# EAGLE design MrMIDI RevA (EAGLE 6.6.0)
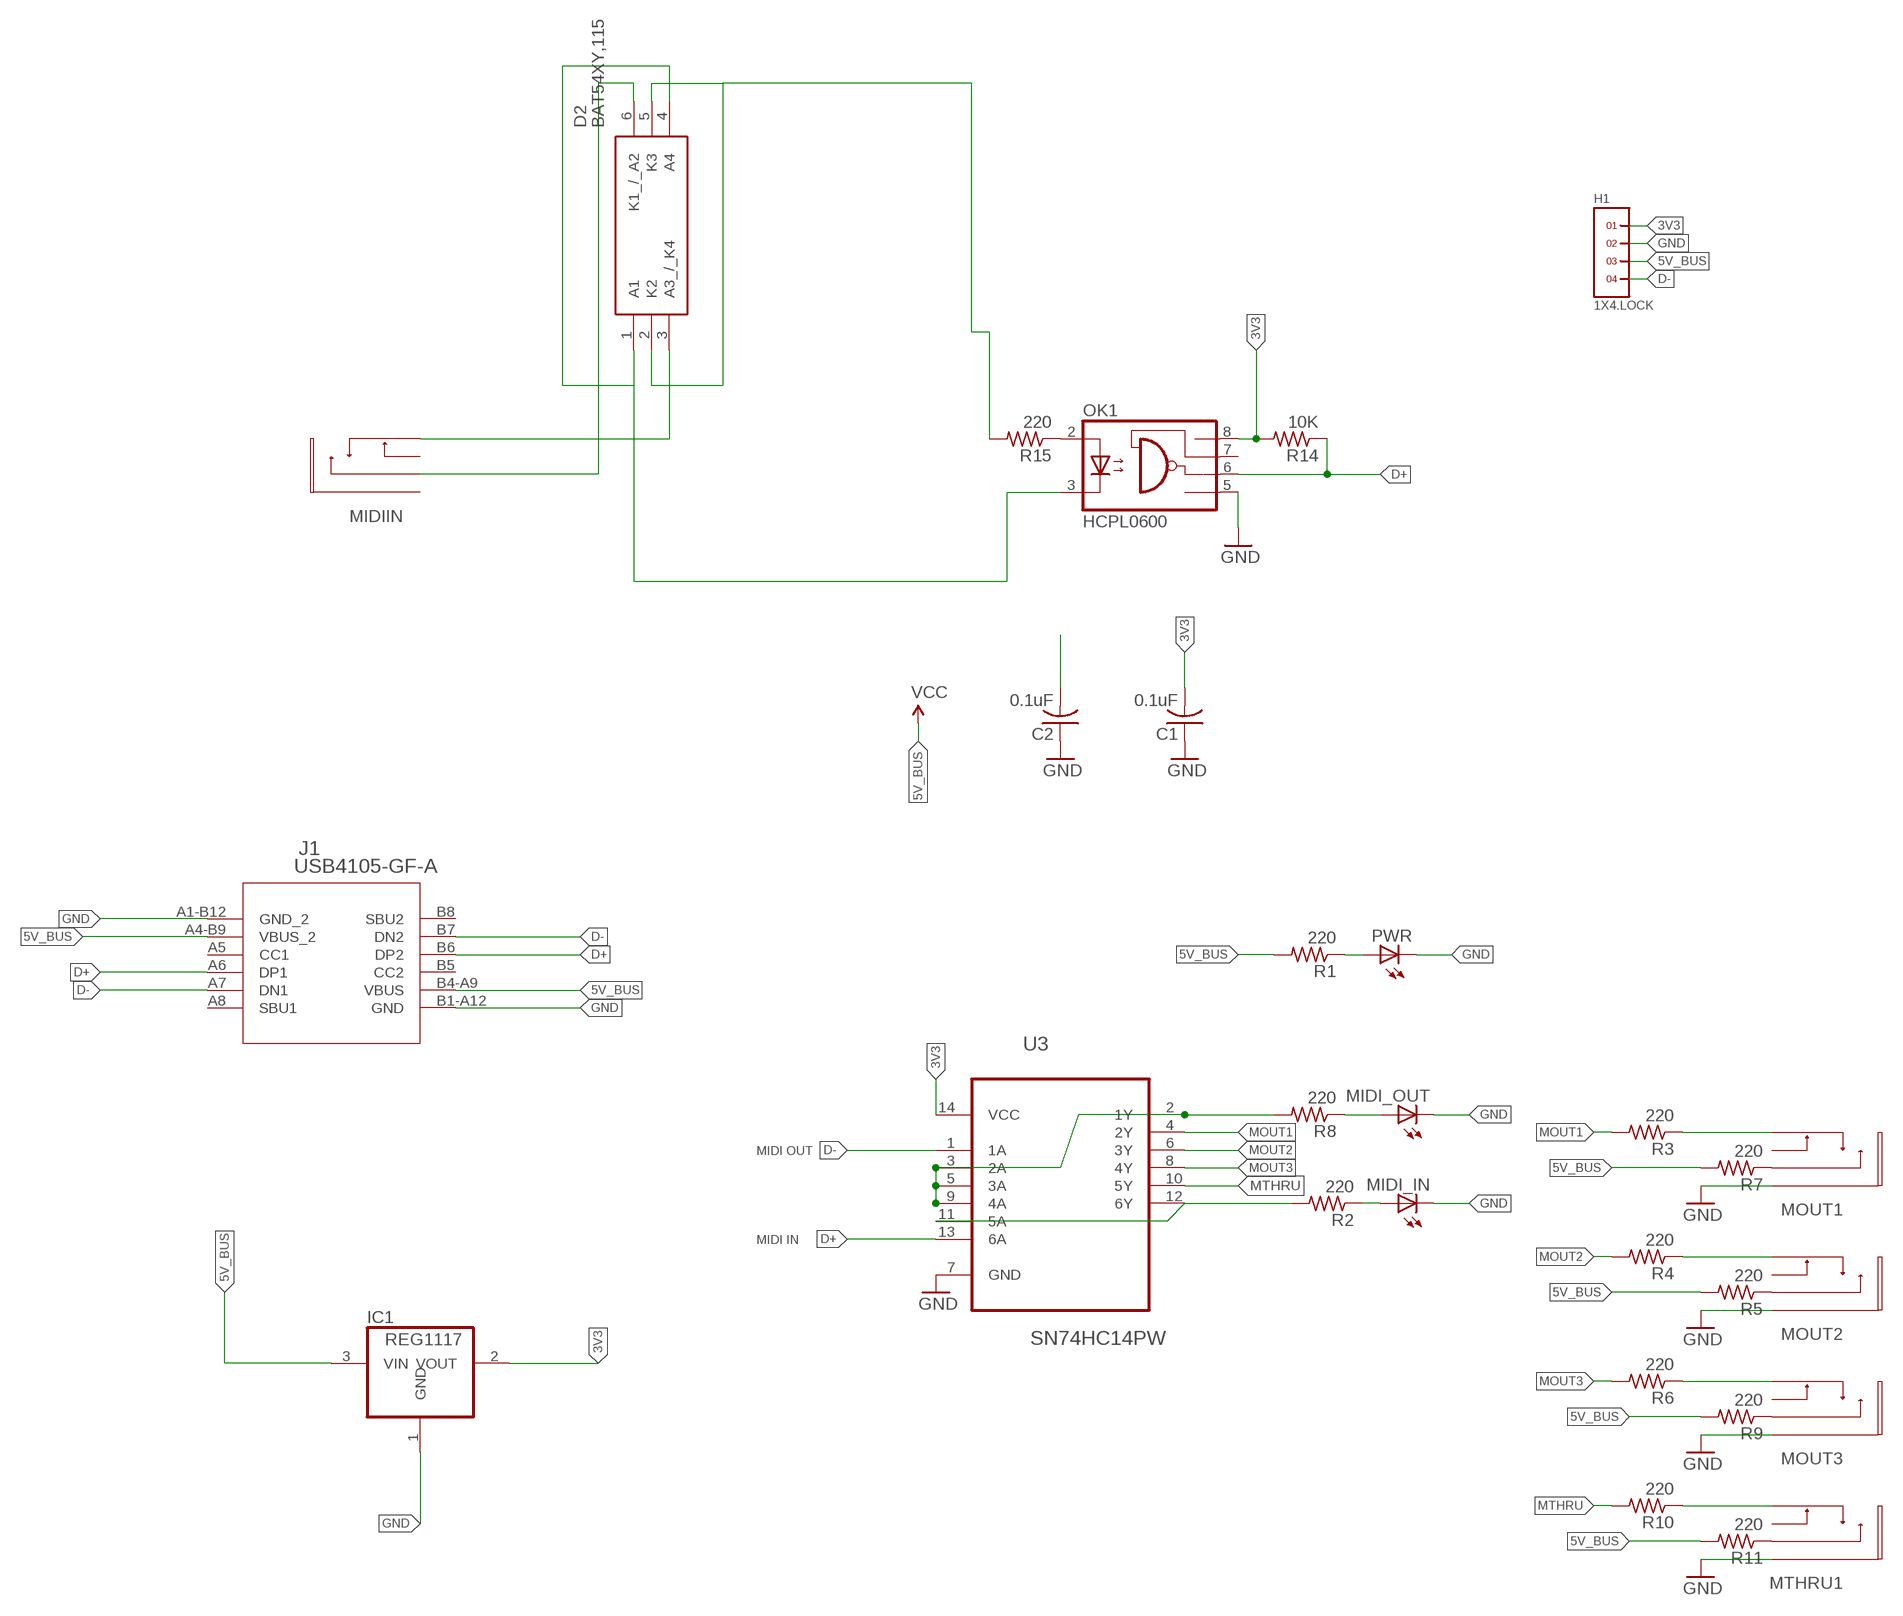
[diagram p0: schematic, sheet 1]

## Parts
C1  0.1uF  RCL_C-USC0603K  [RCL_C0603K]
C2  0.1uF  RCL_C-USC0603K  [RCL_C0603K]
D2  BAT54XY,115  [SOT65P210X110-6N]
H1  1X4.LOCK  [1X4.LOCK]
IC1  REG1117  [SOT223]
J1  USB4105-GF-A  [USB4105_GCT]
MIDI_IN  LEDCHIPLED_0603  [CHIPLED_0603]
MIDI_OUT  LEDCHIPLED_0603  [CHIPLED_0603]
MIDIIN  PJ327E  [PJ327]
MOUT1  PJ327E  [PJ327]
MOUT2  PJ327E  [PJ327]
MOUT3  PJ327E  [PJ327]
MTHRU1  PJ327E  [PJ327]
OK1  HCPL0600  [SOIC08]
PWR  LEDCHIPLED_0603  [CHIPLED_0603]
R1  220  RCL_R-US_R0402  [RCL_R0402]
R2  220  RCL_R-US_R0402  [RCL_R0402]
R3  220  RCL_R-US_R0402  [RCL_R0402]
R4  220  RCL_R-US_R0402  [RCL_R0402]
R5  220  RCL_R-US_R0402  [RCL_R0402]
R6  220  RCL_R-US_R0402  [RCL_R0402]
R7  220  RCL_R-US_R0402  [RCL_R0402]
R8  220  RCL_R-US_R0402  [RCL_R0402]
R9  220  RCL_R-US_R0402  [RCL_R0402]
R10  220  RCL_R-US_R0402  [RCL_R0402]
R11  220  RCL_R-US_R0402  [RCL_R0402]
R14  10K  RCL_R-US_R0402  [RCL_R0402]
R15  220  RCL_R-US_R0402  [RCL_R0402]
U3  SN74HC14PW  [SOP65P640X120-14N]

## Nets
3V3: C1.2 H1.1 IC1.2(VOUT) OK1.8(VCC) R14.2 U3.14(VCC)
5V_BUS: C2.2 H1.3 IC1.3(VIN) J1.A4-B9(VBUS_2) J1.B4-A9(VBUS) R1.2 R5.2 R7.2 R9.2 R11.2 ; supply symbol labelled VCC
D+: J1.A6(DP1) J1.B6(DP2) OK1.6(VO) R14.1 U3.13(6A)
D-: H1.4 J1.A7(DN1) J1.B7(DN2) U3.1(1A)
GND: C1.1 C2.1 H1.2 IC1.1(GND) J1.A1-B12(GND_2) J1.B1-A12(GND) MIDI_IN.C MIDI_OUT.C MOUT1.P$1 MOUT1.P$4 MOUT2.P$1 MOUT2.P$4 MOUT3.P$1 MOUT3.P$4 MTHRU1.P$1 MTHRU1.P$4 OK1.5(GND) PWR.C U3.7(GND)
MIDI_IN_RING: D2.6(K1_/_A2) MIDIIN.P$3
MIDI_IN_TIP: D2.3(A3_/_K4) MIDIIN.P$2
MOUT1: R3.2 U3.4(2Y)
MOUT2: R4.2 U3.6(3Y)
MOUT3: R6.2 U3.8(4Y)
MTHRU: R10.2 U3.10(5Y)
N$1: MIDI_OUT.A R8.1
N$3: D2.1(A1) D2.4(A4) OK1.3(C)
N$5: R2.2 U3.11(5A) U3.12(6Y)
N$6: R8.2 U3.2(1Y) U3.3(2A) U3.5(3A) U3.9(4A)
N$7: MOUT1.P$3 R7.1
N$8: MOUT1.P$2 R3.1
N$9: MOUT2.P$3 R5.1
N$10: MOUT2.P$2 R4.1
N$11: MOUT3.P$3 R9.1
N$12: MOUT3.P$2 R6.1
N$13: MTHRU1.P$3 R11.1
N$14: MTHRU1.P$2 R10.1
N$15: MIDI_IN.A R2.1
N$17: OK1.2(A) R15.1
N$19: D2.2(K2) D2.5(K3) R15.2
N$21: PWR.A R1.1
Unconnected: J1.A5(CC1) J1.A8(SBU1) J1.B5(CC2) J1.B8(SBU2) MIDIIN.P$1 MIDIIN.P$4 MIDIIN.P$5 MOUT1.P$5 MOUT2.P$5 MOUT3.P$5 MTHRU1.P$5 OK1.7(VE)

## Notes on the sheet
- MIDI OUT
- MIDI IN

## Library data of the parts
C1 C2 = ioboard:RCL_C-US: CAPACITOR, American symbol
D2 = SamacSys_Parts:BAT54XY,115: Nexperia BAT54XY,115 Quad SMT Schottky Diode, 2x Series Pair, 30V 200mA, 6-Pin SOT-363 Source: Datasheet <https://assets.nexperia.com/documents/data-sheet/BAT54XY.pdf>; DESCRIPTION: Nexperia BAT54XY,115 Quad SMT Schottky Diode, 2x Series Pair, 30V 200mA, 6-Pin SOT-363; HEIGHT: 1.1mm; MANUFACTURER_NAME: Nexperia; MANUFACTURER_PART_NUMBER: BAT54XY,115; MOUSER_PART_NUMBER: 771-BAT54XY-T/R; MOUSER_PRICE-STOCK: https://www.mouser.co.uk/ProductDetail/Nexperia/BAT54XY115?qs=me8TqzrmIYV24GB%252BtDdQuA%3D%3D
H1 = headers(.1in):1X4
IC1 = clouds_v02:REG1117: 800mA and 1A Low Dropout (LDO) Positive Regulator 1.8V, 2.5V, 2.85V, 3.3V, 5V, and Adj
J1 = 0Raph's Lib:USB4105-GF-A; COPYRIGHT: Copyright (C) 2022 Ultra Librarian. All rights reserved.; DIGI-KEY_PART_NUMBER_1: 2073-USB4105-GF-ACT-ND; DIGI-KEY_PART_NUMBER_2: 2073-USB4105-GF-ADKR-ND; DIGI-KEY_PART_NUMBER_3: 2073-USB4105-GF-ATR-ND; MANUFACTURER_PART_NUMBER: USB4105-GF-A; MFR_NAME: Global Connector Technology
MIDI_IN MIDI_OUT PWR = led:LED: LED OSRAM: - CHIPLED LG R971, LG N971, LY N971, LG Q971, LY Q971, LO R971, LY R971 LH N974, LH R974 LS Q976, LO Q976, LY Q976 LO Q996 - Hyper CHIPLED LW Q18S LB Q993, LB Q99A, LB R99A - SideLED LS A670, LO A670, LY A670, LG A670, LP A670 LB A673, LV A673, LT A673, LW A673 LH A674 LY A675 LS A676, LA A676, LO A676, LY A676, LW A676 LS A679, LY A679, LG A679 - Hyper Micro SIDELED® LS Y876, LA Y876, LO Y876, LY Y876 LT Y87S - SmartLED LW L88C, LW L88S LB L89C, LB L89S, LG L890 LS L89K, LO L89K, LY L89K LS L896, LA L896, LO L896, LY L896 - TOPLED LS T670, LO T670, LY T670, LG T670, LP T670 LSG T670, LSP T670, LSY T670, LOP T670, LYG T670 LG T671, LOG T671, LSG T671 LB T673, LV T673, LT T673, LW T673 LH T674 LS T676, LA T676, LO T676, LY T676, LB T676, LH T676, LSB T676, LW T676 LB T67C, LV T67C, LT T67C, LS T67K, LO T67K, LY T67K, LW E67C LS E67B, LA E67B, LO E67B, LY E67B, LB E67C, LV E67C, LT E67C LW T67C LS T679, LY T679, LG T679 LS T770, LO T770, LY T770, LG T770, LP T770 LB T773, LV T773, LT T773, LW T773 LH T774 LS E675, LA E675, LY E675, LS T675 LS T776, LA T776, LO T776, LY T776, LB T776 LHGB T686 LT T68C, LB T68C - Hyper Mini TOPLED® LB M676 - Mini TOPLED Santana® LG M470 LS M47K, LO M47K, LY M47K Source: http://www.osram.convergy.de LUXEON: - LUMILED® LXK2-PW12-R00, LXK2-PW12-S00, LXK2-PW14-U00, LXK2-PW14-V00 LXK2-PM12-R00, LXK2-PM12-S00, LXK2-PM14-U00 LXK2-PE12-Q00, LXK2-PE12-R00, LXK2-PE12-S00, LXK2-PE14-T00, LXK2-PE14-U00 LXK2-PB12-K00, LXK2-PB12-L00, LXK2-PB12-M00, LXK2-PB14-N00, LXK2-PB14-P00, LXK2-PB14-Q00 LXK2-PR12-L00, LXK2-PR12-M00, LXK2-PR14-Q00, LXK2-PR14-R00 LXK2-PD12-Q00, LXK2-PD12-R00, LXK2-PD12-S00 LXK2-PH12-R00, LXK2-PH12-S00 LXK2-PL12-P00, LXK2-PL12-Q00, LXK2-PL12-R00 Source: www.luxeon.com KINGBRIGHT: KA-3528ASYC Source: www.kingbright.com
MIDIIN MOUT1-MOUT3 MTHRU1 = 0Raph's Lib:PJ327E
OK1 = optocoupler-2:HCPL0600: HEWLETT PACKARD OPTO COUPLER
R1-R11 R14 R15 = warps_v30:RCL_R-US_: RESISTOR, American symbol
U3 = Raph's Lib:SN74HC14PW: HEX SCHMITT-TRIGGER INVERTERS; MPN: SN74HC14PW; OC_FARNELL: 9591133; OC_NEWARK: 02H5414; PACKAGE: TSSOP-14; SUPPLIER: Texas Instruments

## Board
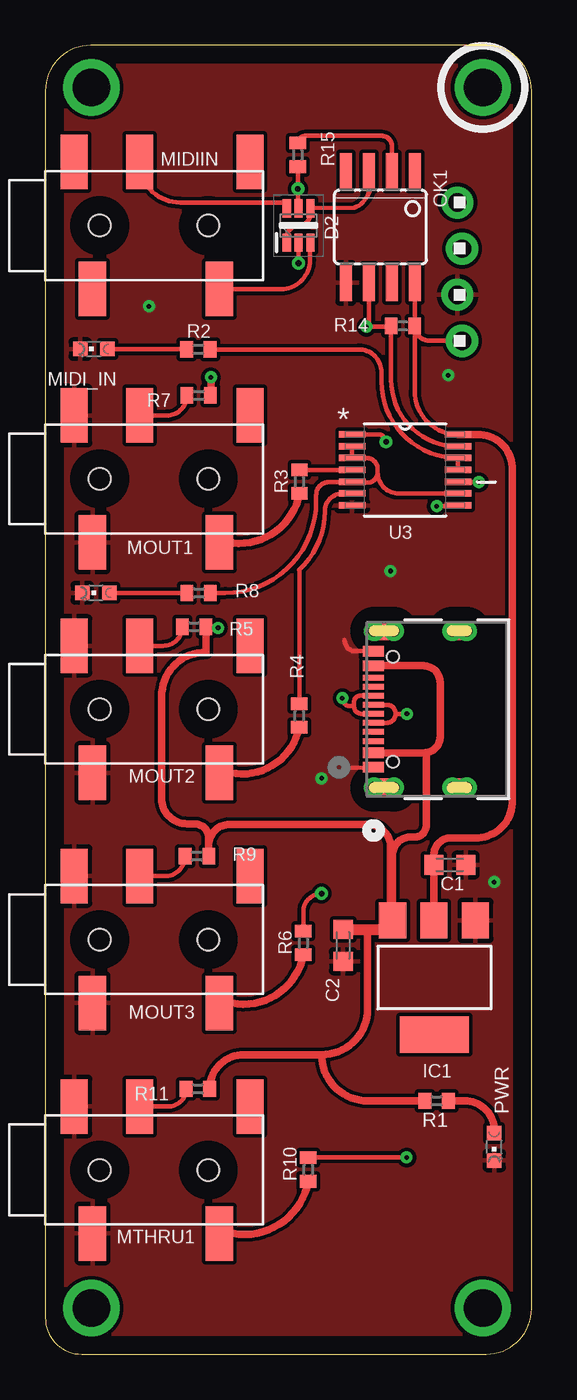
[diagram p1: board, top side]
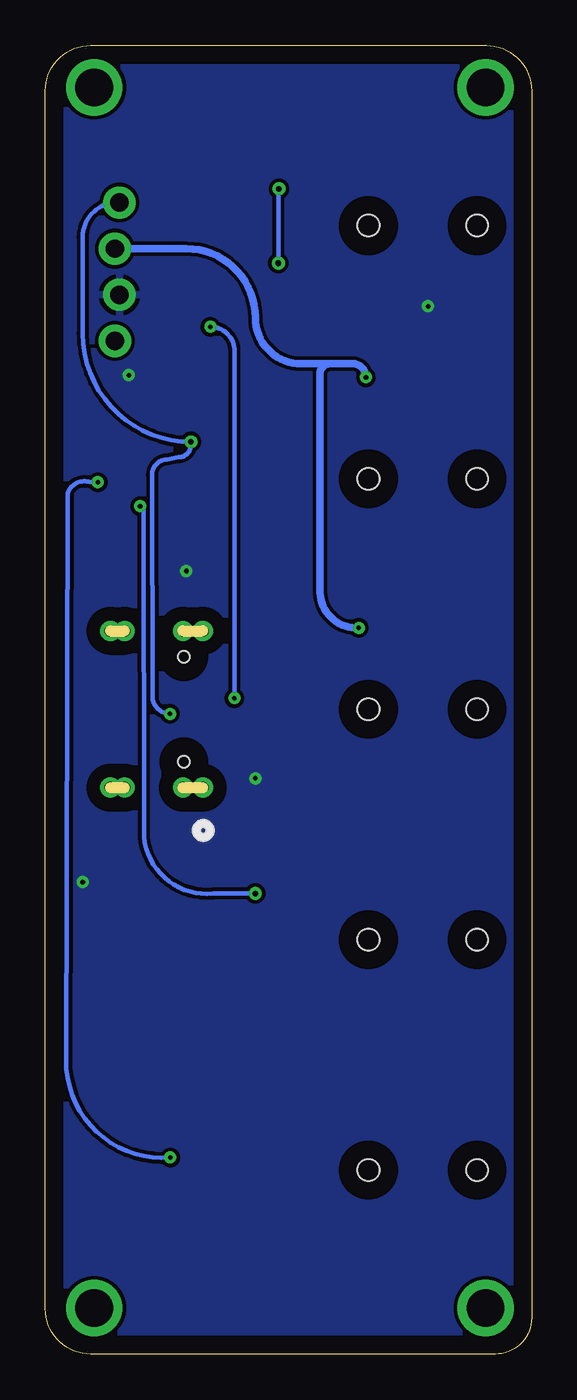
[diagram p2: board, bottom side, seen from below]

Size 26.82 x 72.17 mm. Coordinates in mm from the lower left corner, seen from the top.
Outline: 2,0 24.32,0 arc90 26.82,2.5 26.82,69.67 arc90 24.32,72.17 2.5,72.17 arc90 0,69.67 0,2 arc90 2,0
Copper layers (1*16): Top 0.035mm / dielectric 1.5mm / Bottom 0.035mm
Design rules "default": minimum track width 10mil, minimum drill 24mil, track to track 8mil, track to pad 8mil, pad to pad 8mil, via to via 8mil, smd to smd 8mil, copper to edge 40mil, drill to drill 8mil, minimum pad ring 10mil, minimum via ring 8mil, stop-mask expansion 4mil, vias tented up to drill 25mil, thermal gap 10mil

### Footprints (pad centres in the part's own frame; a part is rotated, then mirrored left to right if it is on the bottom)
RCL_C0603K = smd 1.05 x 1.08: 1 -0.875,0; 2 0.875,0
SOT65P210X110-6N = smd 1 x 0.45: 1 -0.95,0.65; 2 -0.95,0; 3 -0.95,-0.65; 4 0.95,-0.65; 5 0.95,0; 6 0.95,0.65
1X4.LOCK = drill 1.016 pad 1.778: 1 0,-0.127; 2 2.54,0.127; 3 5.08,-0.127; 4 7.62,0.127
SOT223 = smd 1.499 x 2.007: 1 -2.261,-3.15; 2 0.025,-3.15; 3 2.311,-3.15 | smd 3.81 x 2.007: 4 0,3.15
USB4105_GCT = smd 0.991 x 1.803: 13 -4.32,-1.269; 14 4.32,-1.269 | smd 0.991 x 2.108: 15 -4.32,2.911; 16 4.32,2.911 | smd 0.584 x 1.143: A1-B12 -3.2,3.486; A4-B9 -2.4,3.486; B1-A12 3.2,3.486; B4-A9 2.4,3.486 | smd 0.305 x 1.143: A5 -1.25,3.486; A6 -0.25,3.486; A7 0.25,3.486; A8 1.25,3.486; B5 1.75,3.486; B6 0.75,3.486; B7 -0.75,3.486; B8 -1.75,3.486 | drill 0.61 pad 0.61: S_1_H1 -4.318,-0.864; S_1_H2 -4.318,-1.651; S_2_H1 4.318,-0.864; S_2_H2 4.318,-1.651; S_3_H1 -4.318,3.454; S_3_H2 -4.318,2.362; S_4_H1 4.318,3.454; S_4_H2 4.318,2.362 | hole 0.65: -2.896,2.413; 2.896,2.413
CHIPLED_0603 = smd 0.8 x 0.8: A 0,-0.75; C 0,0.75
PJ327 = smd 1.5 x 3: P$1 1.6,3.5; P$2 9.6,-3.5; P$3 5.2,3.5; P$4 2.6,-3.5; P$5 11.3,3.5 | hole 1.2: 3,0; 9,0
SOIC08 = smd 0.66 x 2.032: 1 -1.905,-3.073; 2 -0.635,-3.073; 3 0.635,-3.073; 4 1.905,-3.073; 5 1.905,3.073; 6 0.635,3.073; 7 -0.635,3.073; 8 -1.905,3.073
RCL_R0402 = smd 0.7 x 0.9: 1 -0.65,0; 2 0.65,0
SOP65P640X120-14N = smd 1.473 x 0.356: 1 -2.921,1.956; 2 -2.921,1.295; 3 -2.921,0.66; 4 -2.921,0; 5 -2.921,-0.66; 6 -2.921,-1.295; 7 -2.921,-1.956; 8 2.921,-1.956; 9 2.921,-1.295; 10 2.921,-0.66; 11 2.921,0; 12 2.921,0.66; 13 2.921,1.295; 14 2.921,1.956

### Placement (x,y rotation side)
C1  22.32,26.98 180 top
C2  16.43,22.54 90 top
D2  13.97,62.23 90 top
H1  22.86,55.88 90 top
IC1  21.47,20.77 180 top
J1  21.59,35.56 90 top
MIDI_IN  2.68,55.42 90 top
MIDI_OUT  2.79,41.98 90 top
MIDIIN  0,62.23 0 top
MOUT1  0,48.26 0 top
MOUT2  0,35.56 0 top
MOUT3  0,22.86 0 top
MTHRU1  0,10.16 0 top
OK1  18.49,62.15 180 top
PWR  24.77,11.43 180 top
R1  21.59,13.97 180 top
R2  8.44,55.4 0 top
R3  14.02,48.11 90 top
R4  14.01,35.21 90 top
R5  8.21,40.11 0 top
R6  14.24,22.67 90 top
R7  8.46,52.86 0 top
R8  8.46,41.97 0 top
R9  8.37,27.47 0 top
R10  14.5,10.18 90 top
R11  8.41,14.63 0 top
R14  19.73,56.7 0 top
R15  13.93,66.13 270 top
U3  19.85,48.75 0 top
U$1  [MSW_LOGO_0.5"]  17.11,10.73 0 top

### Tracks (layer width: path | path; a pad name or v marks a point on that pad's centre or on a via)
3V3
  Top 0.254: OK1.8 20.39,56.72 arc-90 R14.2 | R14.2 20.38,53.1 arc90 U3.14 | H1.1 21.2,55.88 arc-90 R14.2
  Top 0.406: IC1.2 C1.2 arc90 C1.2 21.44,27.53 arc-90 22.39,28.47 23.69,28.47 arc90 25.76,30.38 25.75,48.77 arc90 24.01,50.7 U3.14 arc-90 U3.14
5V_BUS  (via drill 0.25)
  Top 0.254: J1.A4-B9 arc90 J1.A4-B9
  Top 0.406: J1.B4-A9 20.85,37.96 arc-90 21.78,37.03 21.78,34.02 arc-90 20.92,33.16 | 20.92,33.16 J1.A4-B9 | IC1.3 19.16,27.54 arc-90 20.13,28.51 20.37,28.51 arc90 21.02,29.15 21.02,33.06 arc90 20.92,33.16 | R11.2 arc-90 10.95,16.51 15.24,16.51 | 15.24,16.51 arc90 17.78,19.05 17.78,23.42 | R9.2 9.02,28.07 | 9.02,28.07 arc-90 10.16,29.21 17.78,29.21 arc-90 19.05,27.94 19.05,23.42 | 9.02,28.07 9.02,28.46 arc90 8.23,29.25 7.81,29.25 arc-90 6.42,30.64 6.42,36.27 arc-90 8.86,38.71 8.86,40.1 arc90 R5.2 arc90 8.91,40.05 v9.53,40.05 | R7.2 arc90 9.14,52.89 v9.14,53.87 | R1.2 17.78,13.97 arc-90 15.24,16.51
  Top 0.61: C2.2 17.78,23.42 19.05,23.42 19.16,23.42 IC1.3
  Bottom 0.406: v9.14,53.87 arc-90 9.89,54.62 11.08,54.62 | 11.08,54.62 arc-90 11.67,54.04 11.67,41.98 arc-90 v9.53,40.05 | H1.3 19.05,60.96 arc90 15.24,57.15 arc-90 12.7,54.61 11.1,54.61 arc-90 11.08,54.62
D+  (via drill 0.25)
  Top 0.254: U3.13 arc-90 19.08,53.74 R14.1 arc-90 19.02,56.65 v17.71,56.65 arc90 17.85,56.79 OK1.6 | J1.A6 17.45,35.31 arc-90 17.03,35.73 | 17.03,35.73 17.03,35.96 arc-90 17.38,36.31 J1.B6 arc90 J1.B6 | 17.03,35.73 16.83,35.73 arc-90 v16.39,36.17
  Bottom 0.254: v16.39,36.17 16.39,55.32 arc-90 v17.71,56.65
D-  (via drill 0.25, 0.3)
  Top 0.254: J1.B7 18.82,34.81 arc90 19.32,35.31 19.32,35.32 | 19.32,35.32 arc90 18.84,35.81 J1.A7 arc-90 J1.A7 | U3.1 18.39,50.71 arc-90 v18.79,50.31 | v19.95,35.31 19.33,35.31 arc-90 19.32,35.32
  Bottom 0.254: v19.95,35.31 arc90 20.91,36.29 20.94,48.49 arc90 20.09,49.33 19.47,49.46 arc-90 18.79,50.14 v18.79,50.31 arc90 24.77,56.28 24.77,61.59 arc90 22.86,63.5 H1.4
GND  (via drill 0.25)
  Top 0.254: J1.A1-B12 16.72,32.32 arc-90 16.67,32.38 | J1.B1-A12 17.12,38.76 arc-90 16.51,39.37
  other vias: 15.24,31.75 24.77,26.04 22.23,53.97 5.71,57.78 19.05,43.18
  pour Top: 0,77.47 27.94,77.47 27.94,-6.35 0,-6.35
  pour Bottom: -10.16,76.2 33.02,76.2 33.02,-5.08 -10.16,-5.08
MIDI_IN_RING
  Top 0.254: MIDIIN.P$3 arc90 7.43,63.5 13,63.5 arc-90 D2.6
MIDI_IN_TIP
  Top 0.254: MIDIIN.P$2 13.01,58.73 arc90 14.61,60.33 14.61,61.27 arc-90 D2.3
MOUT1
  Top 0.254: R3.2 U3.4 arc-90 U3.4
MOUT2
  Top 0.254: U3.6 16.4,47.46 arc90 15.42,46.48 arc-48 13.99,43.23 14.01,43.23 R4.2
MOUT3  (via drill 0.25, 0.3)
  Top 0.254: R6.2 14.24,24.4 arc-90 v15.24,25.4 | v21.59,46.75 22.73,46.76 arc90 U3.8
  Bottom 0.254: v15.24,25.4 17.58,25.4 arc90 21.38,28.53 21.4,46.64 arc-90 v21.59,46.75
MTHRU  (via drill 0.25)
  Top 0.254: U3.10 23.91,48.09 arc-90 v23.93,48.08 | v19.93,10.84 R10.2 arc90 R10.2
  Bottom 0.254: v23.93,48.08 23.95,48.08 arc90 23.95,48.08 24.35,48.08 arc-90 25.59,47.46 25.66,15.73 arc-90 v19.93,10.84
N$1
  Top 0.254: MIDI_OUT.A 7.8,41.98 arc-90 R8.1
N$2  (via drill 2.08)
  other vias: 2.54,69.85
N$3
  Top 0.254: D2.1 13.32,61.58 arc-90 13.97,62.23 arc90 14.62,62.88 D2.4 17.05,63.21 arc90 OK1.3
N$4  (via drill 2.08)
  other vias: 24.13,69.85
N$5
  Top 0.254: R2.2 17.29,55.4 arc-90 18.55,54.15 18.55,53.63 arc90 U3.12 U3.11
N$6
  Top 0.254: U3.2 U3.3 17.71,49.41 arc-90 18.34,48.79 18.34,48.62 | 18.34,48.62 arc-90 17.77,48.05 16.97,48.05 arc-90 U3.5 arc-90 U3.5 15.64,48.08 arc90 14.94,47.38 14.94,47 arc-90 9.92,41.97 R8.2 | U3.9 19.5,47.46 arc-90 18.34,48.62
N$7
  Top 0.254: MOUT1.P$3 6.71,51.76 arc90 R7.1
N$8
  Top 0.406: MOUT1.P$2 10.05,44.76 arc90 R3.1
N$9
  Top 0.254: MOUT2.P$3 6.51,39.06 arc90 R5.1
N$10
  Top 0.406: MOUT2.P$2 10.24,32.06 arc90 R4.1
N$11
  Top 0.254: MOUT3.P$3 6.61,26.36 arc90 R9.1
N$12
  Top 0.406: MOUT3.P$2 10.3,19.36 arc90 R6.1
N$13
  Top 0.254: MTHRU1.P$3 6.79,13.66 arc90 R11.1
N$14
  Top 0.406: MTHRU1.P$2 10.36,6.66 arc90 R10.1
N$15
  Top 0.254: MIDI_IN.A 7.77,55.42 arc-90 R2.1
N$16  (via drill 2.08)
  other vias: 2.54,2.54
N$17
  Top 0.254: OK1.2 19.12,66.61 arc90 18.55,67.18 14.33,67.18 arc90 R15.1
N$18  (via drill 2.08)
  other vias: 24.13,2.54
N$19  (via drill 0.3)
  Top 0.254: R15.2 v13.94,64.25 13.94,63.22 | 13.94,63.22 arc90 D2.5 arc-90 13.94,63.22 | D2.2 v13.97,60.16 arc-90 v13.97,60.16
  Bottom 0.254: v13.97,60.16 13.97,64.22 arc90 v13.94,64.25
N$21
  Top 0.406: R1.1 23.27,13.97 arc-90 PWR.A

### Text on the board
bDocu: THIS IS NOT / A USB PORT | MiSTer MIDI Breakout / MiSW 2023